# EAGLE schematic motorsteuerung (EAGLE 7.6.0)
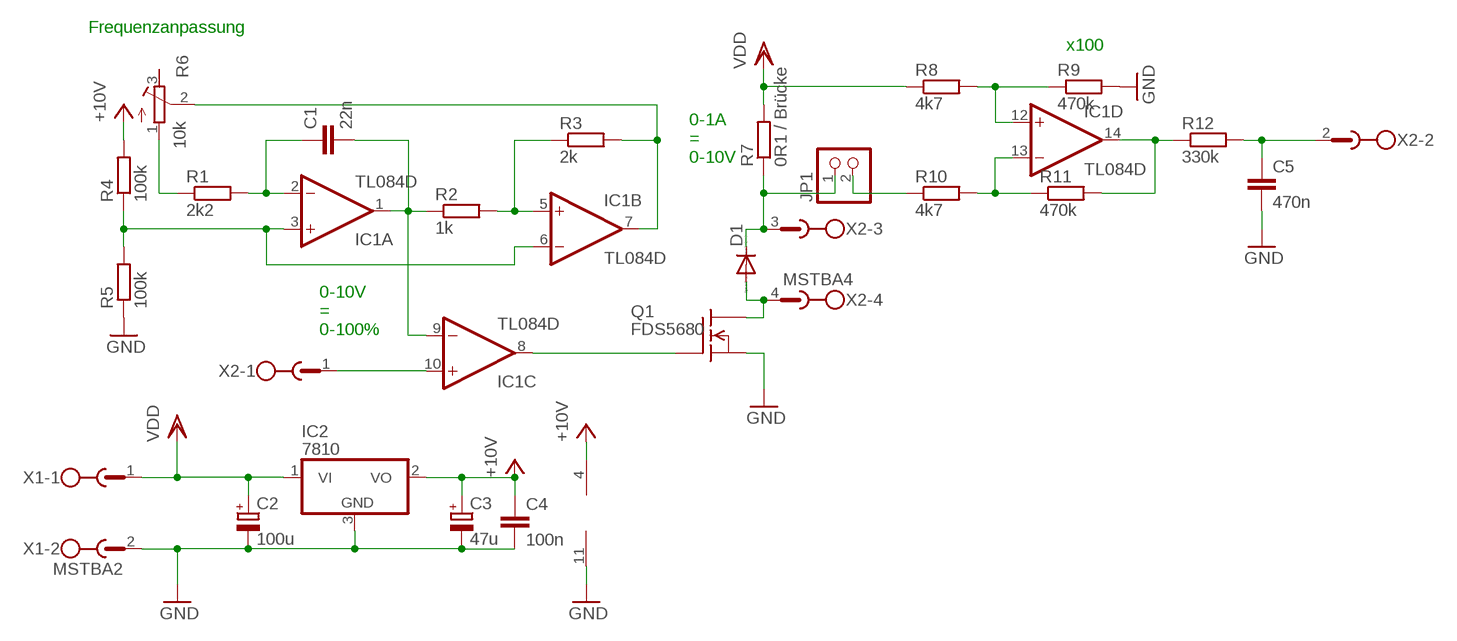
[diagram p0: schematic, sheet 1]

## Parts
C1  22n  C-EUC1206  [C1206]
C2  100u  CPOL-EUE3.5-8  [E3,5-8]
C3  47u  CPOL-EUE3.5-8  [E3,5-8]
C4  100n  C-EUC1206  [C1206]
C5  470n  C-EUC1206  [C1206]
D1  1N4148DO35-7  [DO35-7]
IC1  TL084D  [SO14]
IC2  7810  7805DT  [TO252]
JP1  PINHD-1X2  [1X02]
Q1  FDS5680  [SO-8]
R1  2k2  R-EU_R1206  [R1206]
R2  1k  R-EU_R1206  [R1206]
R3  2k  R-EU_R1206  [R1206]
R4  100k  R-EU_R1206  [R1206]
R5  100k  R-EU_R1206  [R1206]
R6  10k  R-TRIMM4G/J  [RTRIM4G/J]
R7  0R1 / Brücke  R-EU_R2512  [R2512]
R8  4k7  R-EU_R1206  [R1206]
R9  470k  R-EU_R1206  [R1206]
R10  4k7  R-EU_R1206  [R1206]
R11  470k  R-EU_R1206  [R1206]
R12  330k  R-EU_R1206  [R1206]
X1  MSTBA2  [MSTBA2]
X2  MSTBA4  [MSTBA4]

## Nets
GND: C2.- C3.- C4.2 C5.2 IC1.11(P:V-) IC2.3(GND) Q1.1(S) Q1.2(S) Q1.3(S) R5.1 R9.2 X1.2
N$1: C1.1 IC1.2(A:-IN) R1.2
N$2: C1.2 IC1.1(A:OUT) IC1.9(C:-IN) R2.1
N$3: IC1.3(A:+IN) IC1.6(B:-IN) R4.1 R5.2
N$4: D1.A Q1.5(D) Q1.6(D) Q1.7(D) Q1.8(D) X2.4
N$5: IC1.5(B:+IN) R2.2 R3.1
N$6: IC1.7(B:OUT) R3.2 R6.2(S)
N$7: IC1.10(C:+IN) X2.1
N$8: IC1.8(C:OUT) Q1.4(G)
N$9: R1.1 R6.1(A)
N$10: JP1.2 R10.1
N$11: D1.C JP1.1 R7.1 X2.3
N$12: IC1.12(D:+IN) R8.2 R9.1
N$13: IC1.13(D:-IN) R10.2 R11.1
N$14: IC1.14(D:OUT) R11.2 R12.1
N$17: C5.1 R12.2 X2.2
VCC: C3.+ C4.1 IC1.4(P:V+) IC2.2(VO) R4.2 ; supply symbol labelled +10V
VDD: C2.+ IC2.1(VI) R7.2 R8.1 X1.1
Unconnected: R6.3(E)

## Notes on the sheet
- Frequenzanpassung
- x100
- 0-1A
  =
  0-10V
- 0-10V
  =
  0-100%

## Library data of the parts
C1 C4 C5 = rcl:C-EU: CAPACITOR, European symbol
C2 C3 = rcl:CPOL-EU: POLARIZED CAPACITOR, European symbol
D1 = diode:1N4148: DIODE high speed (Philips)
IC1 = linear:TL084: OP AMP
IC2 = linear:78*: Positive VOLTAGE REGULATOR Source: http://cache.national.com/ds/LM/LM78L05.pdf http://www.fairchildsemi.com/ds/LM/LM7805.pdf
JP1 = pinhead:PINHD-1X2: PIN HEADER
Q1 = transistor-fet:FDS5680: 60V N-Channel PowerTrench TM MOSFET FAIRCHILD FDS5680.pdf
R1-R5 R7-R12 = rcl:R-EU_: RESISTOR, European symbol
R6 = rcl:R-TRIMM: Trimm resistor
X1 = con-phoenix-508:MSTBA2: PHOENIX; MF: FARNELL; MPN: 1757242; OC_FARNELL: 3705171; OC_NEWARK: 71C4161
X2 = con-phoenix-508:MSTBA4: PHOENIX; MF: FARNELL; MPN: 1757268; OC_FARNELL: 3705195; OC_NEWARK: 71C4163